# Altium schematic sheet v2.0.SchDoc
size 139 x 76 mm; PageSetup: Record=PageOptions|CenterHorizontal=True|CenterVertical=True|PrintScale=0.71|XCorrection=1.00|YCorrection=1.00|PrintKind=1|BorderSize=5000000|LeftOffset=0|BottomOffset=0|Orientation=2|PaperLength=1000|PaperWidth=1000|Scale=100|PaperSource=15|PrintQuality=4000|MediaType=1|DitherType=10|PrintScaleMode=1|PaperKind=A4|PaperIndex=9
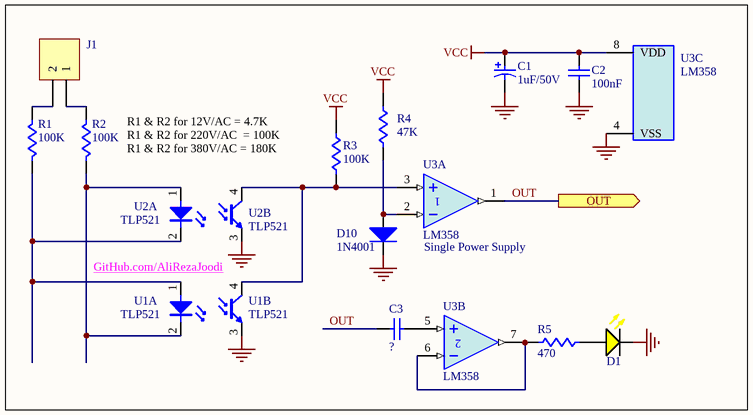
[diagram p0: v2.0.SchDoc]

## Parts
C1  1uF/50V  [C_THD_EL_(P2.54-D6-H11)]
C2  100nF  [C_THD_CER_(P2.54-D3.5-T1.5)]
C3  ?  [C_THD_CER_(P2.54-D3.5-T1.5)]
D1  YELLOW  [LED_THD_5MM_YELLOW]  (value not drawn)
D10  1N4001  [DIODE-0.4]
J1  Header 2  [Fonics_2PIN_1]  (value not drawn)
R1  value 100K  [AXIAL-0.4]  (hidden comment: Res1)
R2  value 100K  [AXIAL-0.4]  (hidden comment: Res1)
R3  value 100K  [AXIAL-0.4]  (hidden comment: Res1)
R4  value 47K  [AXIAL-0.4]  (hidden comment: Res1)
R5  value 470  [AXIAL-0.4]  (hidden comment: Res1)
U1  value TLP521  [DIP-4]  (hidden comment: Optoisolator)  (parts A,B of 2)
U2  value TLP521  [DIP-4]  (hidden comment: Optoisolator)  (parts A,B of 2)
U3  LM358  [DIP_8]  (parts A,B,C of 3)

## Ports
OUT (out)

## Nets
GND: C1.2 C2.2 D1.2(K) D10.2(K) U1.3(E) U2.3(E) U3.4(VSS)
VCC: C1.1 C2.1 R3.1 R4.1 U3.8(VDD)
OUT: C3.1 U3.1(OUT) ; port OUT
NetC3_2: C3.2 U3.5(IN+)
NetD1_1: D1.1(A) R5.2
NetD10_1: D10.1(A) R4.2 U3.2(IN-)
NetJ1_1: J1.1 R2.1
NetJ1_2: J1.2 R1.1
NetR1_2: R1.2 U1.1(A) U2.2(K)
NetR2_2: R2.2 U1.2(K) U2.1(A)
NetR3_2: R3.2 U1.4(C) U2.4(C) U3.3(IN+)
NetR5_1: R5.1 U3.6(IN-) U3.7(OUT)

## Notes on the sheet
- (near U2) R1 & R2 for 12V/AC = 4.7K
  R1 & R2 for 220V/AC  = 100K
  R1 & R2 for 380V/AC = 180K
- (near U1) GitHub.com/AliRezaJoodi
- Single Power Supply

## Library data of the parts
C1 = Capacitor_Electrolytic: Capacitor, Electrolytic; Revision: July-2002: Re-released for DXP Platform.
C2 C3 = Capacitor_Ceramic: Capacitor, Ceramic Multilayer; Revision: July-2002: Re-released for DXP Platform.
D1 = LED_YELLOW: LED, Yellow; Manufacturer: Generic Components; Class I: Optoelectronic; Published: 8-Jun-2000; Revision: July-2002: Re-released for DXP Platform.; Publisher: Altium Limited; Class II: LED
D10 = Diode: Default Diode; Manufacturer: Generic Components; Class I: Discrete; Class II: Diode - Switching; Published: 8-Jun-2000; Revision: July-2002: Re-released for DXP Platform.; Publisher: Altium Limited
J1 = Header 2: Header, 2-Pin; LatestRevisionDate: 17-Jul-2002; LatestRevisionNote: Re-released for DXP Platform.; Publisher: Altium Limited
R1-R5 = Res1: Resistor; Manufacturer: Generic Components; Class I: Passive; Published: 8-Jun-2000; Revision: July-2002: Re-released for DXP Platform.; Publisher: Altium Limited; Class II: Resistor
U3 = LM358: Dual Low-Power Operational Amplifier; Published: 17-Jul-2002; LatestRevisionDate: 13-Apr-2006; LatestRevisionNote: IPC-7351 Footprint Added.; DatasheetVersion: 1988; PackageReference: 751-02; Publisher: Altium Limited; PackageDescription: 8-Pin Small Outline Integrated Circuit 1.27 mm Pitch; Code_JEDEC: MS-012-AA; Code_IPC: SOIC127P600-8; ComponentLink1Description: Manufacturer Link; ComponentLink1URL: http://www.onsemi.com/site/products/parametrics/0,4446,251,00.html; ComponentLink2Description: Datasheet; ComponentLink2URL: http://www.onsemi.com/pub/Collateral/LM358-D.PDF
U1 U2 = Optoisolator: Publisher: Altium Limited